# Altium schematic sheet ERRORfourinput.SchDoc
size A4
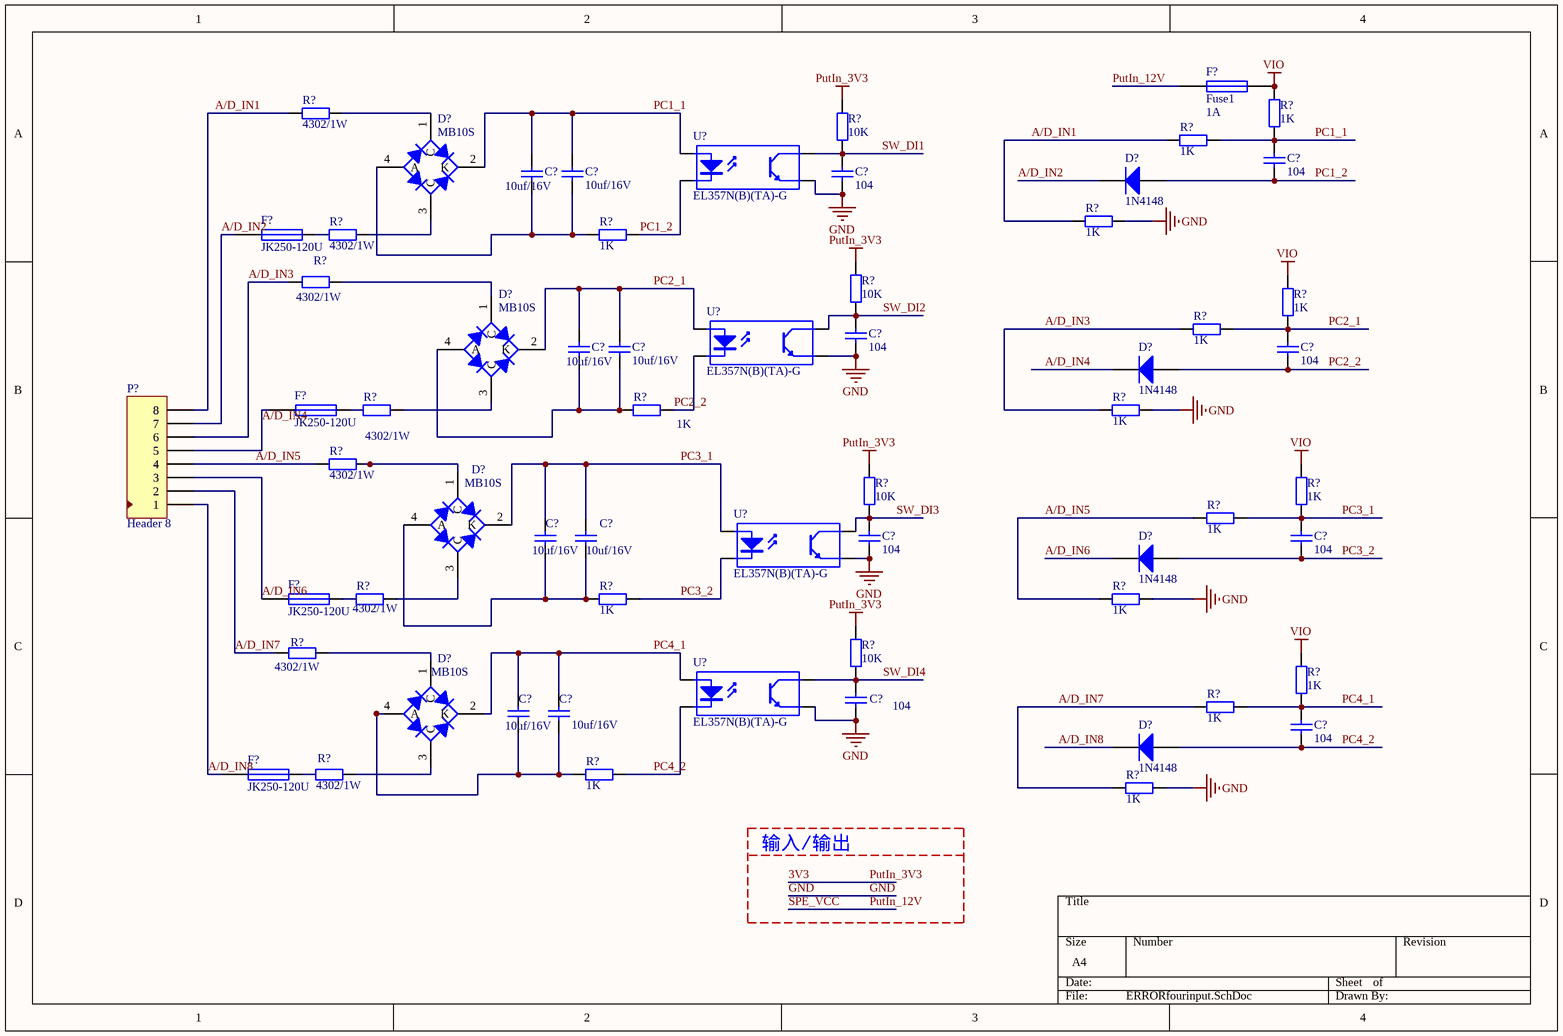
[diagram p0: ERRORfourinput.SchDoc]

## Parts
(Parts that share a designator on the sheet are numbered #1, #2 ... from top to bottom, then left to right.)
C?#1  104  [LC-1206_C]
C?#2  104  [LC-0603_C]
C?#3  10uf/16V  [LC-0805_C]
C?#4  10uf/16V  [LC-0805_C]
C?#5  104  [LC-0603_C]
C?#6  104  [LC-1206_C]
C?#7  10uf/16V  [LC-0805_C]
C?#8  10uf/16V  [LC-0805_C]
C?#9  104  [LC-0603_C]
C?#10  104  [LC-1206_C]
C?#11  10uf/16V  [LC-0805_C]
C?#12  10uf/16V  [LC-0805_C]
C?#13  104  [LC-0603_C]
C?#14  10uf/16V  [LC-0805_C]
C?#15  10uf/16V  [LC-0805_C]
C?#16  104  [LC-1206_C]
D?#1  MB10S  [LC-MBS]
D?#2  1N4148  [LC-LL-34]
D?#3  MB10S  [LC-MBS]
D?#4  1N4148  [LC-LL-34]
D?#5  MB10S  [LC-MBS]
D?#6  1N4148  [LC-LL-34]
D?#7  MB10S  [LC-MBS]
D?#8  1N4148  [LC-LL-34]
F?#1  Fuse1  value 1A  [LC-1206_R]
F?#2  JK250-120U  [ntc250v]
F?#3  JK250-120U  [ntc250v]
F?#4  JK250-120U  [ntc250v]
F?#5  JK250-120U  [ntc250v]
P?  Header 8  [5.08-8p]
R?#1  4302/1W  [LC-2512_R]
R?#2  value 1K  [LC-1206_R]  (hidden comment: Res1)
R?#3  10K  [LC-0603_R]
R?#4  value 1K  [LC-1206_R]  (hidden comment: Res1)
R?#5  4302/1W  [LC-2512_R]
R?#6  value 1K  [LC-1206_R]  (hidden comment: Res1)
R?#7  1K  [LC-0603_R]
R?#8  4302/1W  [LC-2512_R]
R?#9  value 1K  [LC-1206_R]  (hidden comment: Res1)
R?#10  10K  [LC-0603_R]
R?#11  value 1K  [LC-1206_R]  (hidden comment: Res1)
R?#12  4302/1W  [LC-2512_R]
R?#13  value 1K  [LC-1206_R]  (hidden comment: Res1)
R?#14  1K  [LC-0603_R]
R?#15  4302/1W  [LC-2512_R]
R?#16  value 1K  [LC-1206_R]  (hidden comment: Res1)
R?#17  10K  [LC-0603_R]
R?#18  value 1K  [LC-1206_R]  (hidden comment: Res1)
R?#19  4302/1W  [LC-2512_R]
R?#20  value 1K  [LC-1206_R]  (hidden comment: Res1)
R?#21  1K  [LC-0603_R]
R?#22  4302/1W  [LC-2512_R]
R?#23  10K  [LC-0603_R]
R?#24  value 1K  [LC-1206_R]  (hidden comment: Res1)
R?#25  value 1K  [LC-1206_R]  (hidden comment: Res1)
R?#26  4302/1W  [LC-2512_R]
R?#27  1K  [LC-0603_R]
R?#28  value 1K  [LC-1206_R]  (hidden comment: Res1)
U?#1  EL357N(B)(TA)-G  [LC-SOP-4_P2.54]
U?#2  EL357N(B)(TA)-G  [LC-SOP-4_P2.54]
U?#3  EL357N(B)(TA)-G  [LC-SOP-4_P2.54]
U?#4  EL357N(B)(TA)-G  [LC-SOP-4_P2.54]

## Nets
3V3: R?#3.2 R?#10.2 R?#17.2 R?#23.2  [also labelled PutIn_3V3]
GND: C?#2.2 C?#5.2 C?#9.2 C?#13.2 R?#6.1 R?#13.1 R?#20.1 R?#28.1 U?#1.3(E) U?#2.3(E) U?#3.3(E) U?#4.3(E)
VIO: F?#1.2 R?#2.2 R?#9.1 R?#16.1 R?#24.1
A/D_IN1: P?.8 R?#1.1 R?#4.2 R?#6.2
A/D_IN2: D?#2.2(K) F?#2.1 P?.7
A/D_IN3: P?.6 R?#8.1 R?#11.2 R?#13.2
A/D_IN4: D?#4.2(K) F?#3.1 P?.5
A/D_IN5: P?.4 R?#15.1 R?#18.2 R?#20.2
A/D_IN6: D?#6.2(K) F?#4.1 P?.3
A/D_IN7: P?.2 R?#22.1 R?#25.2 R?#28.2
A/D_IN8: D?#8.2(K) F?#5.1 P?.1
PC1_1: C?#1.1 C?#3.2 C?#4.2 D?#1.2(K) R?#2.1 R?#4.1 U?#1.1(A)
PC1_2: C?#1.2 D?#2.1(A) R?#7.1 U?#1.2(K)
PC2_1: C?#6.1 C?#7.2 C?#8.2 D?#3.2(K) R?#9.2 R?#11.1 U?#2.1(A)
PC2_2: C?#6.2 D?#4.1(A) R?#14.1 U?#2.2(K)
PC3_1: C?#10.1 C?#11.2 C?#12.2 D?#5.2(K) R?#16.2 R?#18.1 U?#3.1(A)
PC3_2: C?#10.2 D?#6.1(A) R?#21.1 U?#3.2(K)
PC4_1: C?#14.2 C?#15.2 C?#16.1 D?#7.2(K) R?#24.2 R?#25.1 U?#4.1(A)
PC4_2: C?#16.2 D?#8.1(A) R?#27.1 U?#4.2(K)
PutIn_12V: F?#1.1  [also labelled SPE_VCC]
SW_DI1: C?#2.1 R?#3.1 U?#1.4(C)
SW_DI2: C?#5.1 R?#10.1 U?#2.4(C)
SW_DI3: C?#9.1 R?#17.1 U?#3.4(C)
SW_DI4: C?#13.1 R?#23.1 U?#4.4(C)
NetC?#3_1: C?#3.1 C?#4.1 D?#1.4(A) R?#7.2
NetC?#7_1: C?#7.1 C?#8.1 D?#3.4(A) R?#14.2
NetC?#11_1: C?#11.1 C?#12.1 D?#5.4(A) R?#21.2
NetC?#14_1: C?#14.1 C?#15.1 D?#7.4(A) R?#27.2
NetD?#1_1: D?#1.1(C) R?#1.2
NetD?#1_3: D?#1.3(C) R?#5.2
NetD?#3_1: D?#3.1(C) R?#8.2
NetD?#3_3: D?#3.3(C) R?#12.2
NetD?#5_1: D?#5.1(C) R?#15.2
NetD?#5_3: D?#5.3(C) R?#19.2
NetD?#7_1: D?#7.1(C) R?#22.2
NetD?#7_3: D?#7.3(C) R?#26.2
NetF?#2_2: F?#2.2 R?#5.1
NetF?#3_2: F?#3.2 R?#12.1
NetF?#4_2: F?#4.2 R?#19.1
NetF?#5_2: F?#5.2 R?#26.1

## Notes on the sheet
- 输入/输出

## Library data of the parts
C?#1 C?#6 C?#10 C?#16 = Cap: Capacitor; Value: 100nF; Published: 8-Jun-2000; Revision: July-2002: Re-released for DXP Platform.; Publisher: Altium Limited
C?#2-C?#5 C?#7-C?#9 C?#11-C?#15 = Cap: Capacitor; Value: 100pF; Published: 8-Jun-2000; LatestRevisionDate: 17-Jul-2002; LatestRevisionNote: Re-released for DXP Platform.; PackageReference: RAD-0.3; Publisher: Altium Limited; PackageDescription: Radial Cap, Thru-Hole; 2 Leads; 0.3 in Pin Spacing
D?#1 D?#3 D?#5 D?#7 = MBS MB10S: 整流桥; ComponentLink1Description: 供应商链接; ComponentLink1URL: http://www.szlcsc.com/product/details_2865.html; Package: MBS; Supplier: LC; SuppliersPartNumber: C2488
D?#2 D?#4 D?#6 D?#8 = Diode: Default Diode; Published: 8-Jun-2000; LatestRevisionDate: 17-Jul-2002; LatestRevisionNote: Re-released for DXP Platform.; PackageDocument: Sep-1996; PackageReference: SMC; Publisher: Altium Limited; Code_JEDEC: DO-214-AB
F?#1 = Fuse1: 保险丝
F?#2-F?#5 = Fus: 保险丝; Value: 1A
P? = Header 8: 接插件; LatestRevisionDate: 17-Jul-2002; LatestRevisionNote: Re-released for DXP Platform.; Publisher: Altium Limited
R?#1 R?#3 R?#5 R?#8 R?#10 R?#12 R?#15 R?#17 R?#19 R?#22 R?#23 R?#26 = Res2: Resistor; Value: 1K; Published: 8-Jun-2000; LatestRevisionDate: 17-Jul-2002; LatestRevisionNote: Re-released for DXP Platform.; PackageReference: AXIAL-0.4; Publisher: Altium Limited; PackageDescription: Axial Device, Thru-Hole; 2 Leads; 0.4 in Pin Spacing
R?#2 R?#4 R?#6 R?#9 R?#11 R?#13 R?#16 R?#18 R?#20 R?#24 R?#25 R?#28 = Res1: 贴片电阻; Published: 8-Jun-2000; LatestRevisionDate: 17-Jul-2002; LatestRevisionNote: Re-released for DXP Platform.; PackageReference: AXIAL-0.4; Publisher: Altium Limited
R?#7 R?#14 R?#21 R?#27 = Res2: Resistor; Published: 8-Jun-2000; LatestRevisionDate: 17-Jul-2002; LatestRevisionNote: Re-released for DXP Platform.; PackageReference: AXIAL-0.4; Publisher: Altium Limited; PackageDescription: Axial Device, Thru-Hole; 2 Leads; 0.4 in Pin Spacing; Value: 1K
U?#1-U?#4 = EL357N(B)(TA)-G: 贴片光耦; ComponentLink1Description: 供应商链接; ComponentLink1URL: http://www.szlcsc.com/product/details_7114.html; Package: SOP-4_P2.54; Supplier: LC; SuppliersPartNumber: C6649